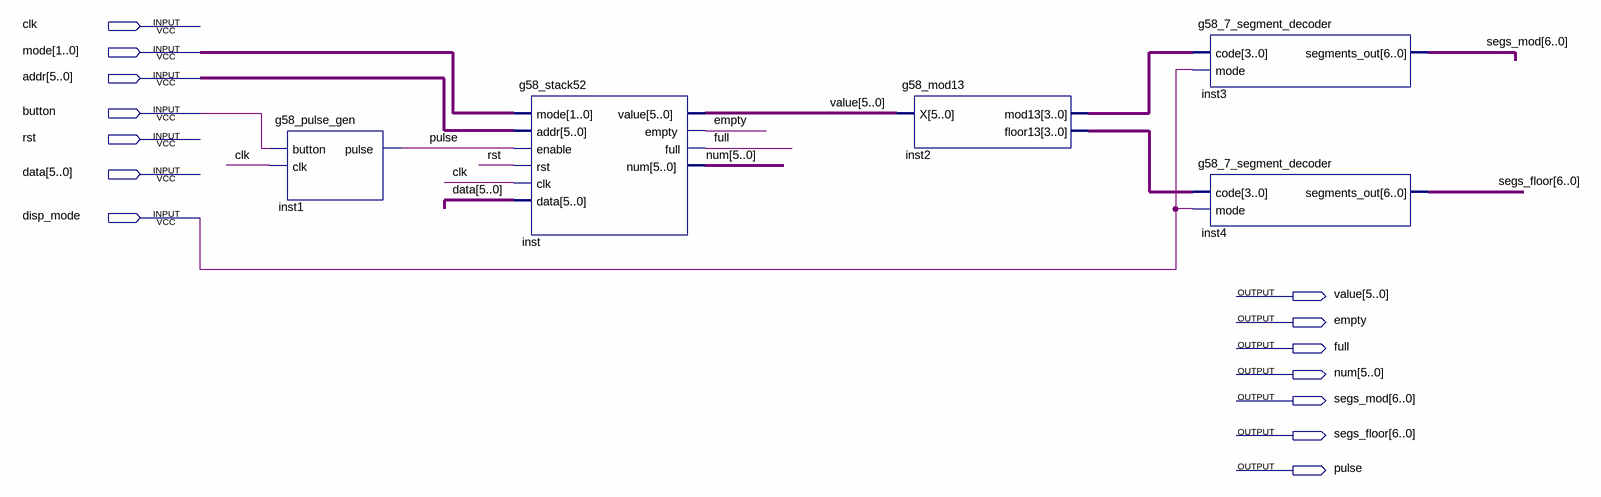
[diagram p0: schematic sheet]
// Quartus schematic g58_stack52_testbed.bdf as structural Verilog: 5 symbols, 14 pins
module g58_stack52_testbed (
  input  clk,
  input  [1:0] mode,
  input  [5:0] addr,
  input  button,
  input  rst,
  input  [5:0] data,
  input  disp_mode,
  output [5:0] value,
  output empty,
  output full,
  output [5:0] num,
  output [6:0] segs_mod,
  output [6:0] segs_floor,
  output pulse
);

  wire [3:0] inst2_floor13, inst2_mod13;

  g58_pulse_gen inst1 (.button(button), .clk(clk), .pulse(pulse));
  g58_stack52 inst (
    .mode(mode), .addr(addr), .enable(pulse), .rst(rst), .clk(clk), .data(data), .value(value),
    .empty(empty), .full(full), .num(num));
  g58_mod13 inst2 (.X(value), .mod13(inst2_mod13), .floor13(inst2_floor13));
  g58_7_segment_decoder inst3 (.code(inst2_mod13), .mode(disp_mode), .segments_out(segs_mod));
  g58_7_segment_decoder inst4 (.code(inst2_floor13), .mode(disp_mode), .segments_out(segs_floor));
endmodule
